# EAGLE design DRONE V3.0 (EAGLE 9.6.2)
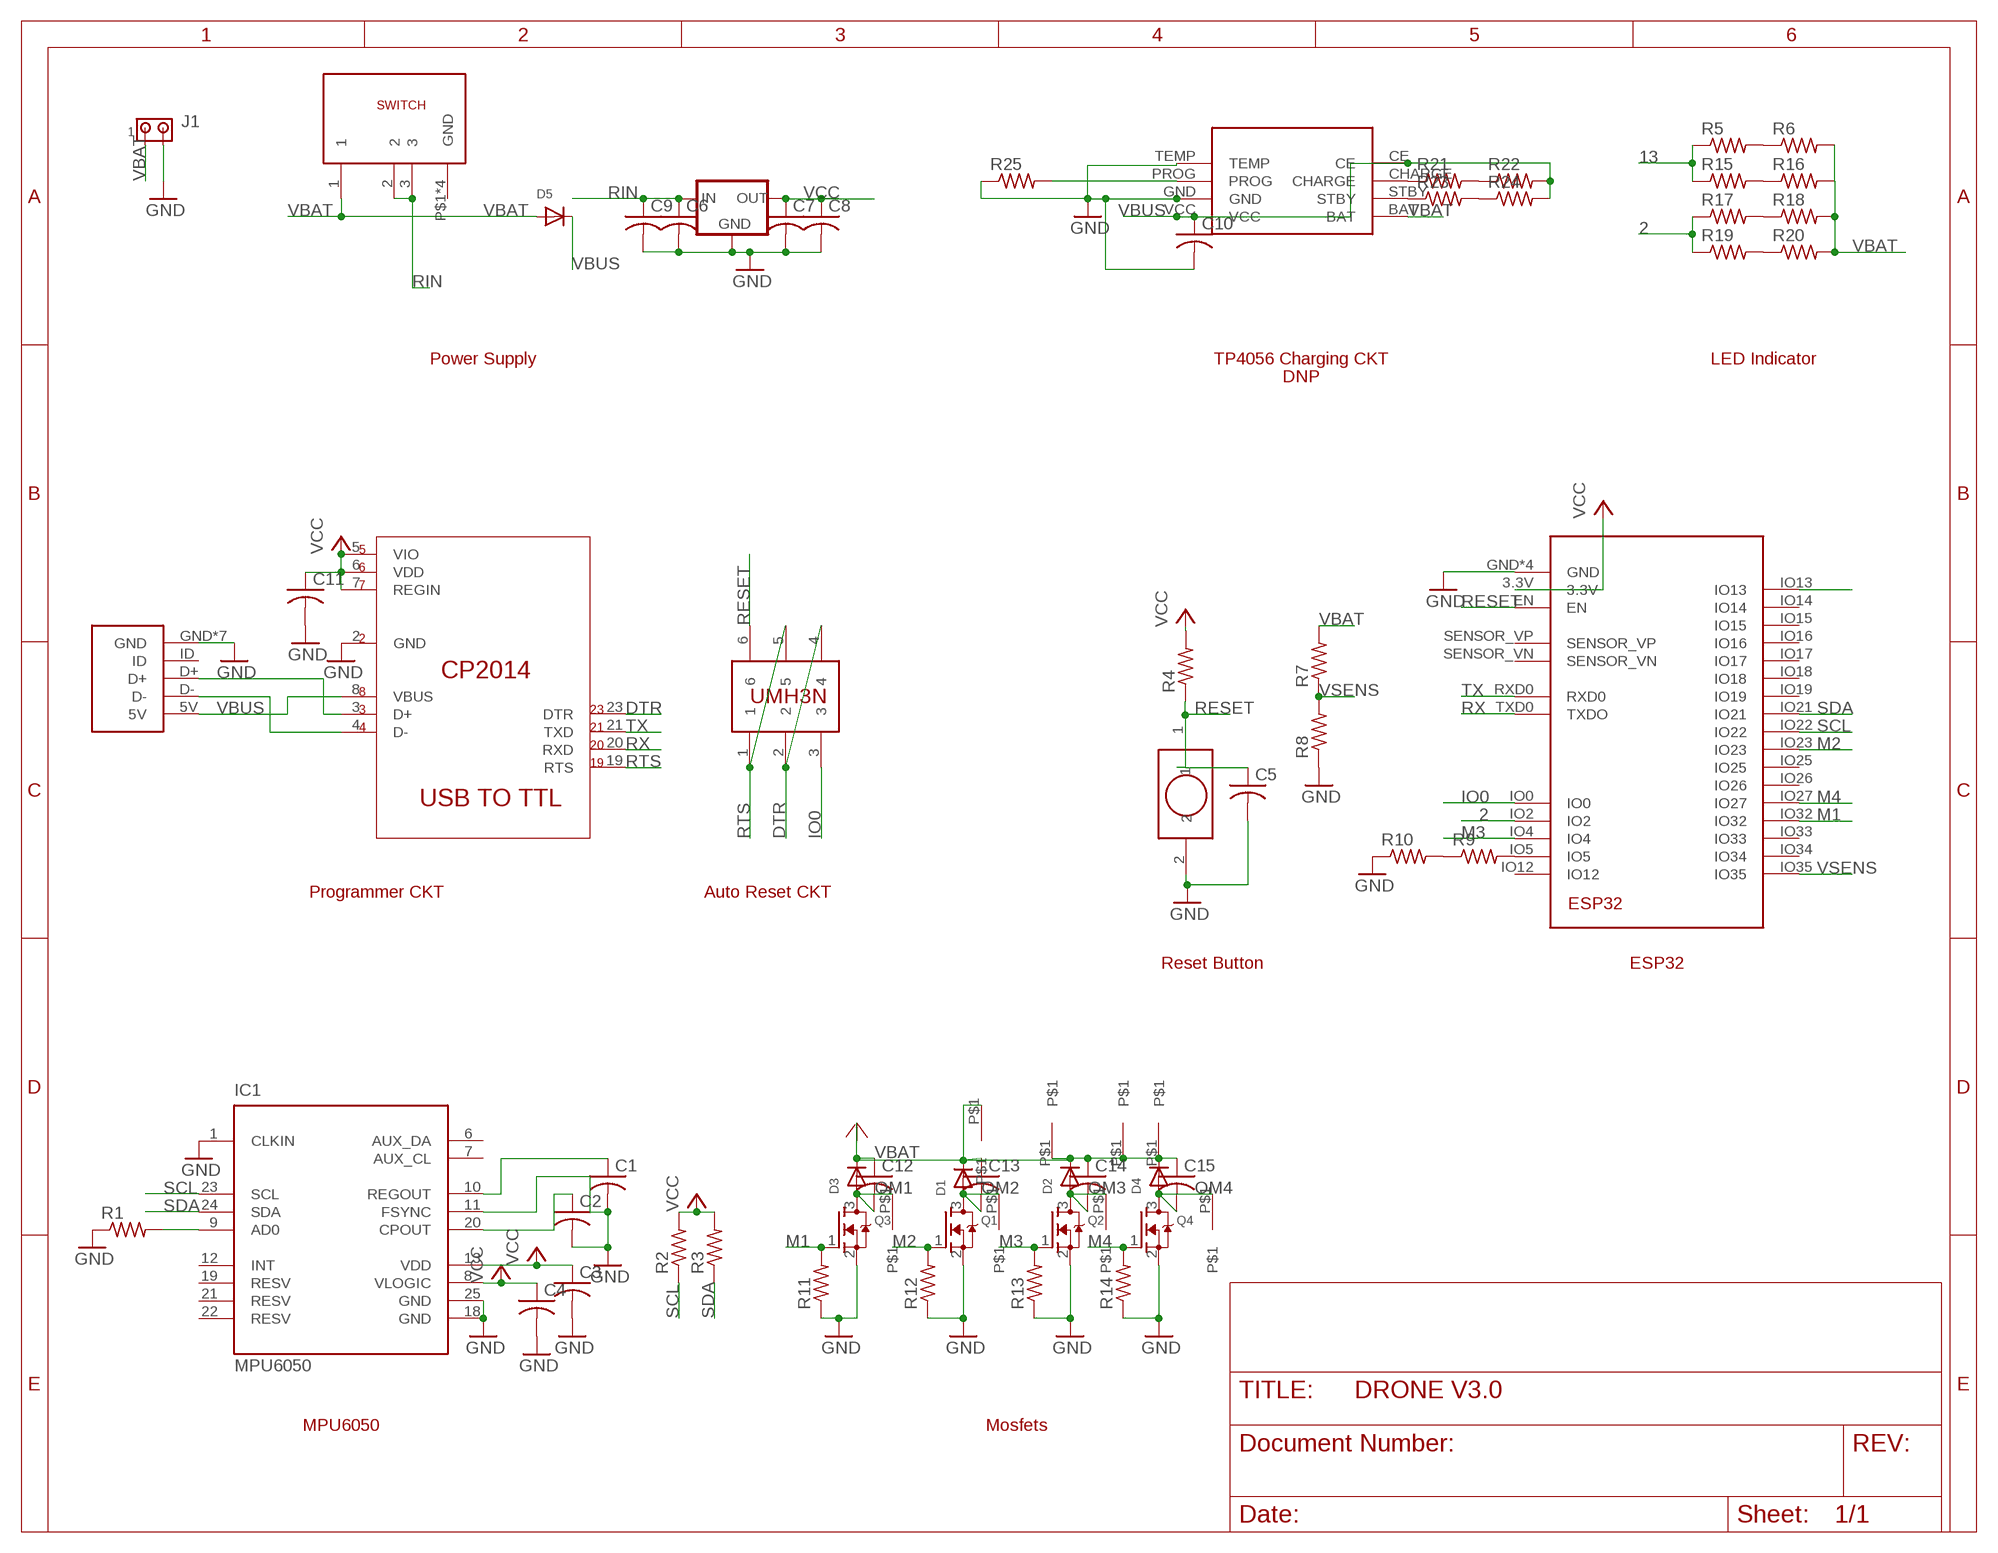
[diagram p0: schematic, sheet 1]

## Parts
C1  C-USC0603  [C0603]
C2  C-USC0603  [C0603]
C3  C-USC0603  [C0603]
C4  C-USC0603  [C0603]
C5  C-USC0603  [C0603]
C6  C-USC0603  [C0603]
C7  C-USC0603  [C0603]
C8  C-USC0603  [C0603]
C9  C-USC0603  [C0603]
C10  C-USC0603  [C0603]
C11  C-USC0603  [C0603]
C12  C-USC0603  [C0603]
C13  C-USC0603  [C0603]
C14  C-USC0603  [C0603]
C15  C-USC0603  [C0603]
D1  DIODESOD-323F  [SOD-323F]
D2  DIODESOD-323F  [SOD-323F]
D3  DIODESOD-323F  [SOD-323F]
D4  DIODESOD-323F  [SOD-323F]
D5  DIODESOD-323F  [SOD-323F]
IC1  MPU6050  [QFN50P400X400X95-25T265X275N]
IC2  V_REG1.8MP  [SOT223]
J1  MTA02-100  [10X02MTA]
Q1  MOSFET-NREFLOW  [SOT23]
Q2  MOSFET-NREFLOW  [SOT23]
Q3  MOSFET-NREFLOW  [SOT23]
Q4  MOSFET-NREFLOW  [SOT23]
R1  R-US_R0603  [R0603]
R2  R-US_R0603  [R0603]
R3  R-US_R0603  [R0603]
R4  R-US_R0603  [R0603]
R5  R-US_R0603  [R0603]
R6  R-US_R0603  [R0603]
R7  R-US_R0603  [R0603]
R8  R-US_R0603  [R0603]
R9  R-US_R0603  [R0603]
R10  R-US_R0603  [R0603]
R11  R-US_R0603  [R0603]
R12  R-US_R0603  [R0603]
R13  R-US_R0603  [R0603]
R14  R-US_R0603  [R0603]
R15  R-US_R0603  [R0603]
R16  R-US_R0603  [R0603]
R17  R-US_R0603  [R0603]
R18  R-US_R0603  [R0603]
R19  R-US_R0603  [R0603]
R20  R-US_R0603  [R0603]
R21  R-US_R0603  [R0603]
R22  R-US_R0603  [R0603]
R23  R-US_R0603  [R0603]
R24  R-US_R0603  [R0603]
R25  R-US_R0603  [R0603]
U1  ESP32  [MODULE_ESP-WROOM-32]
U2  CP2104-F03-GM  [QFN50P400X400X80-25N]
U$1  MICROUSB  [USB]
U$2  SELF_PUSHBUTTON  [SELF_PUSHBUTTON]
U$3  SWITCH  [SWITCH]
U$4  TP4056  [TP4056]
U$6  UMH3N  [UMH3N]
U$7  PINOUTS  [PINOUTS]
U$8  PINOUTS  [PINOUTS]
U$9  PINOUTS  [PINOUTS]
U$10  PINOUTS  [PINOUTS]
U$11  PINOUTS  [PINOUTS]
U$12  PINOUTS  [PINOUTS]
U$13  PINOUTS  [PINOUTS]
U$14  PINOUTS  [PINOUTS]

## Nets
2: R17.1 R19.1 U1.IO2
13: R5.1 R15.1 U1.IO13
DTR: U2.23(DTR) U$6.2 U$6.4
GND: C1.2 C2.2 C3.2 C4.2 C5.2 C6.2 C7.2 C8.2 C9.2 C10.2 C11.2 IC1.1(CLKIN) IC1.11(FSYNC) IC1.18(GND) IC1.25(GND) IC2.GND J1.2 Q1.2(S) Q2.2(S) Q3.2(S) Q4.2(S) R1.1 R8.1 R10.1 R11.1 R12.1 R13.1 R14.1 R25.1 U1.GND U1.GND1(GND) U1.GND2(GND) U1.GND3(GND) U2.2(GND) U$1.GND U$1.GND1(GND) U$1.GND2(GND) U$1.GND3(GND) U$1.GND4(GND) U$1.GND5(GND) U$1.GND6(GND) U$2.2 U$4.GND U$4.TEMP
IO0: U1.IO0 U$6.3
M1: Q3.1(G) R11.2 U1.IO32
M2: Q1.1(G) R12.2 U1.IO23
M3: Q2.1(G) R13.2 U1.IO4
M4: Q4.1(G) R14.2 U1.IO27
N$1: IC1.9(AD0) R1.2
N$2: R5.2 R6.1
N$3: R15.2 R16.1
N$4: C1.1 IC1.10(REGOUT)
N$5: C2.1 IC1.20(CPOUT)
N$6: U2.3(D+) U$1.D+
N$7: U2.4(D-) U$1.D-
N$8: R9.2 U1.IO5
N$9: R9.1 R10.2
N$10: R17.2 R18.1
N$11: R19.2 R20.1
N$12: R21.1 U$4.CHARGE
N$13: R21.2 R22.1
N$14: R23.1 U$4.STBY
N$15: R23.2 R24.1
N$16: R25.2 U$4.PROG
OM1: C12.2 D3.A Q3.3(D) U$12.P$1
OM2: C13.2 D1.A Q1.3(D) U$8.P$1
OM3: C14.2 D2.A Q2.3(D) U$10.P$1
OM4: C15.2 D4.A Q4.3(D) U$13.P$1
RESET: C5.1 R4.1 U1.EN U$2.1 U$6.6
RIN: C6.1 C9.1 IC2.VIN(IN) U$3.2 U$3.3
RTS: U2.19(RTS) U$6.1 U$6.5
RX: U1.TXD0(TXDO) U2.20(RXD)
SCL: IC1.23(SCL) R2.1 U1.IO22
SDA: IC1.24(SDA) R3.1 U1.IO21
TX: U1.RXD0 U2.21(TXD)
VBAT: C12.1 C13.1 C14.1 C15.1 D1.C D2.C D3.C D4.C D5.A J1.1 R6.2 R7.2 R16.2 R18.2 R20.2 U$3.1 U$4.BAT U$7.P$1 U$9.P$1 U$11.P$1 U$14.P$1
VBUS: C10.1 D5.C R22.2 R24.2 U2.8(VBUS) U$1.5V U$4.CE U$4.VCC
VCC: C3.1 C4.1 C7.1 C8.1 C11.1 IC1.8(VLOGIC) IC1.13(VDD) IC2.VOUT1(OUT) IC2.VOUT(OUT) R2.2 R3.2 R4.2 U1.3.3V U2.5(VIO) U2.6(VDD) U2.7(REGIN)
VSENS: R7.1 R8.2 U1.IO35
Unconnected: IC1.2(NC) IC1.3(NC) IC1.4(NC) IC1.5(NC) IC1.6(AUX_DA) IC1.7(AUX_CL) IC1.12(INT) IC1.14(NC) IC1.15(NC) IC1.16(NC) IC1.17(NC) IC1.19(RESV) IC1.21(RESV) IC1.22(RESV) U1.IO12 U1.IO14 U1.IO15 U1.IO16 U1.IO17 U1.IO18 U1.IO19 U1.IO25 U1.IO26 U1.IO33 U1.IO34 U1.SENSOR_VN U1.SENSOR_VP U$1.ID U$3.P$1(GND) U$3.P$2(GND) U$3.P$3(GND) U$3.P$4(GND)

## Notes on the sheet
- Power Supply | TP4056 Charging CKT | LED Indicator
- DNP
- Programmer CKT | Auto Reset CKT
- Reset Button | ESP32
- MPU6050 | Mosfets

## Library data of the parts
C1-C15 = rcl:C-US: CAPACITOR, American symbol; SPICEPREFIX: C
D1-D5 = adafruit:DIODE: Diode SMADIODE - SMA Surface Mount Package 20V 1A Schottky Diode Digikey: 641-1014-6-ND DO-1N4148 - Through Hole Small Current Diode SOD-123 20V 1 A (.5mV Vf) Schottky Diode - Digikey: MBRX120TPMSCT-ND SOD-323 10V 570mA (.38mV Vf, 3ns) Schottky Diode - Digikey: ZLLS410CT-ND SOD-523 30V 30mA Schottky Diode (RB751S-40TE61) - Digikey: RB751S-40TE61CT-ND SOT23-R/W - SOT23 Package (R = Solder Paste/Reflow Ovens, W = Hand-Soldering) BAT54Film 40V 300mA - Digikey: 497-7162-1-ND
IC1 = MPU6050,6000:MPU6050: The triple-axis MEMS gyroscope
IC2 = V_REG:V_REG: 800mA Low-Dropout Linear Regulator Source: http://www.ti.com/lit/ds/symlink/lm1117-n.pdf; MF: Texas Instruments; MPN: LM1117MP-1.8; OC_FARNELL: 1469053; OC_NEWARK: 41K3467
J1 = con-amp:MTA02-100: AMP connector
Q1-Q4 = adafruit:MOSFET-N: N-Channel Mosfet 2N7002E - 60V 260mA SOT23 [Digikey: 2N7002ET1GOSTR-ND] - REEL BSH103 - 30V 850mA SOT23 [Digikey: 568-5013-1-ND]
R1-R25 = rcl:R-US_: RESISTOR, American symbol; SPICEPREFIX: R
U1 = ESP-WROOM-32:ESP32: Module: combo; GPIO, I2C x2, I2S x2, SDIO, SPI x3, UART x3; 19.5dBm
U2 = CP2104:CP2104: Silabs CP2104 USB to UART Bridge; AVAILABILITY: Unavailable; DESCRIPTION: USB Bridge, USB to UART USB 2.0 UART Interface 24-QFN (4x4); MF: Silicon Labs; MP: CP2104; PACKAGE: QFN-24 Silicon Labs; PRICE: None
U$1 = micro usb:MICROUSB
U$2 = SELF-PUSHBUTTON:SELF_PUSHBUTTON
U$3 = SWITCH:SWITCH
U$4 = TP4056:TP4056
U$6 = UMH3N:UMH3N
U$7-U$14 = PIN:PINOUTS

## Board
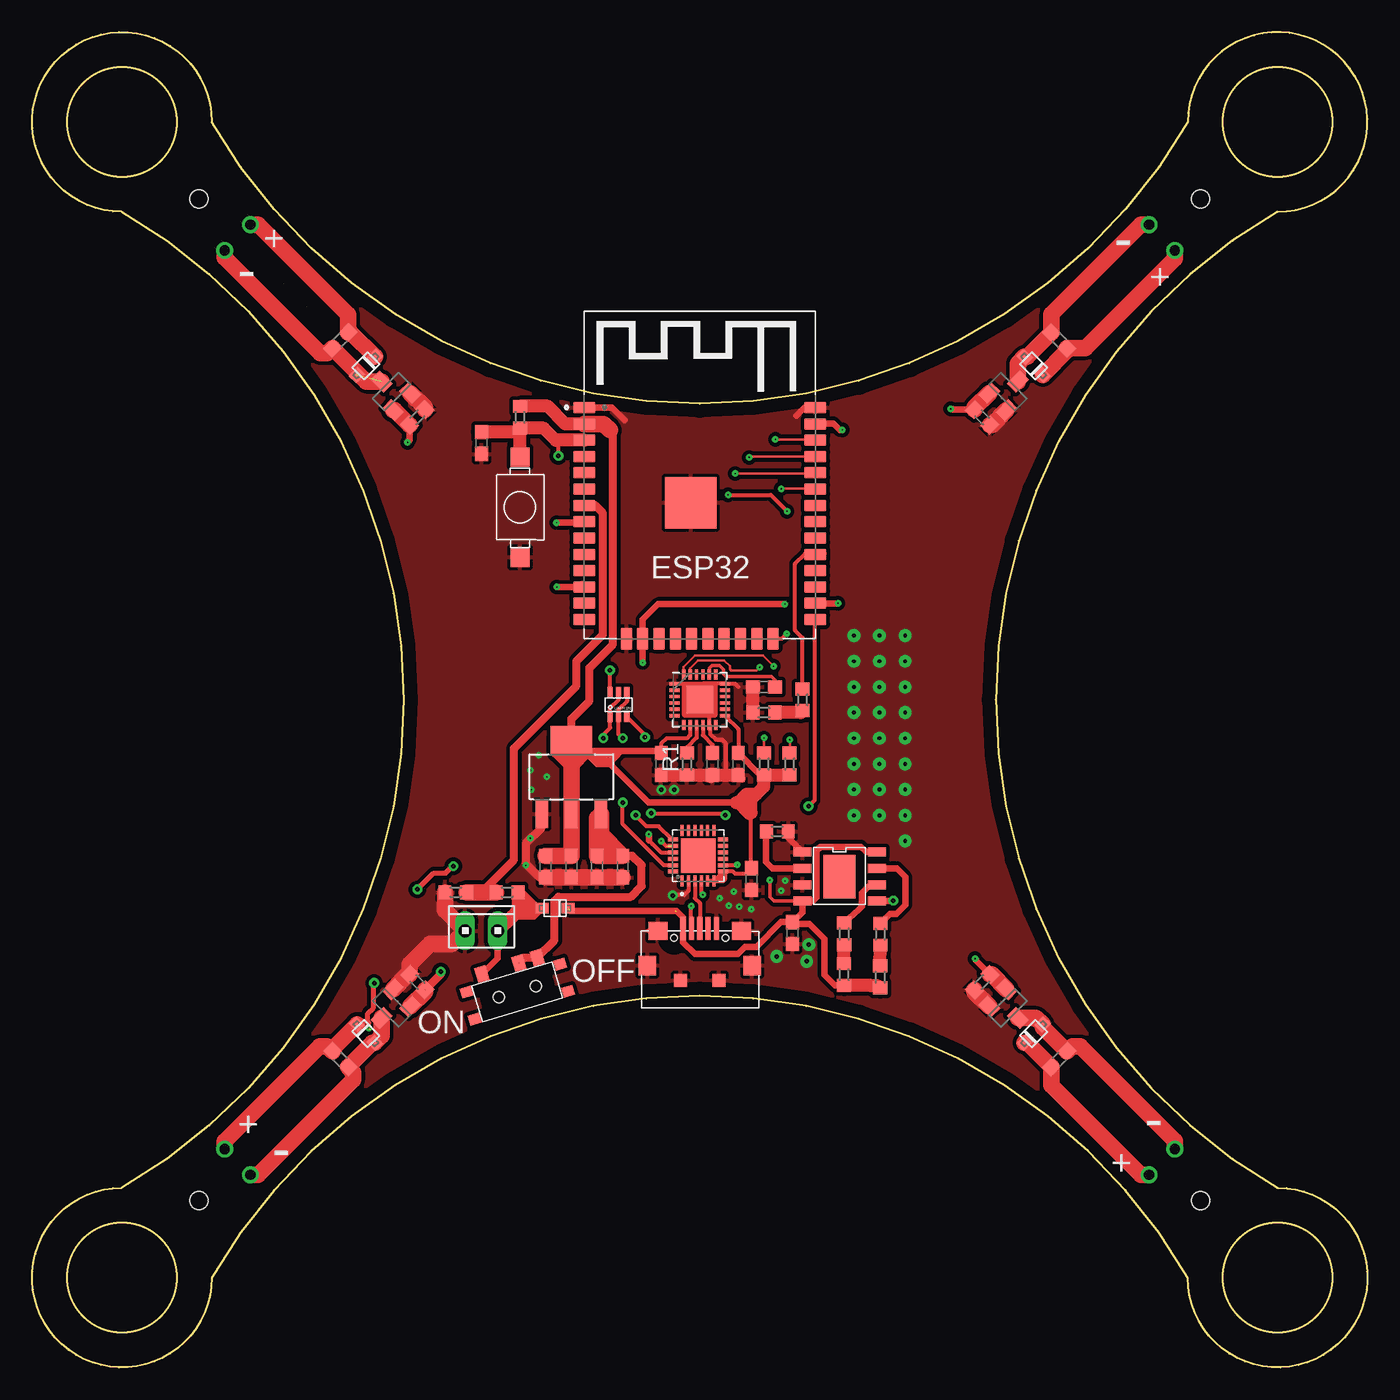
[diagram p1: board, top side]
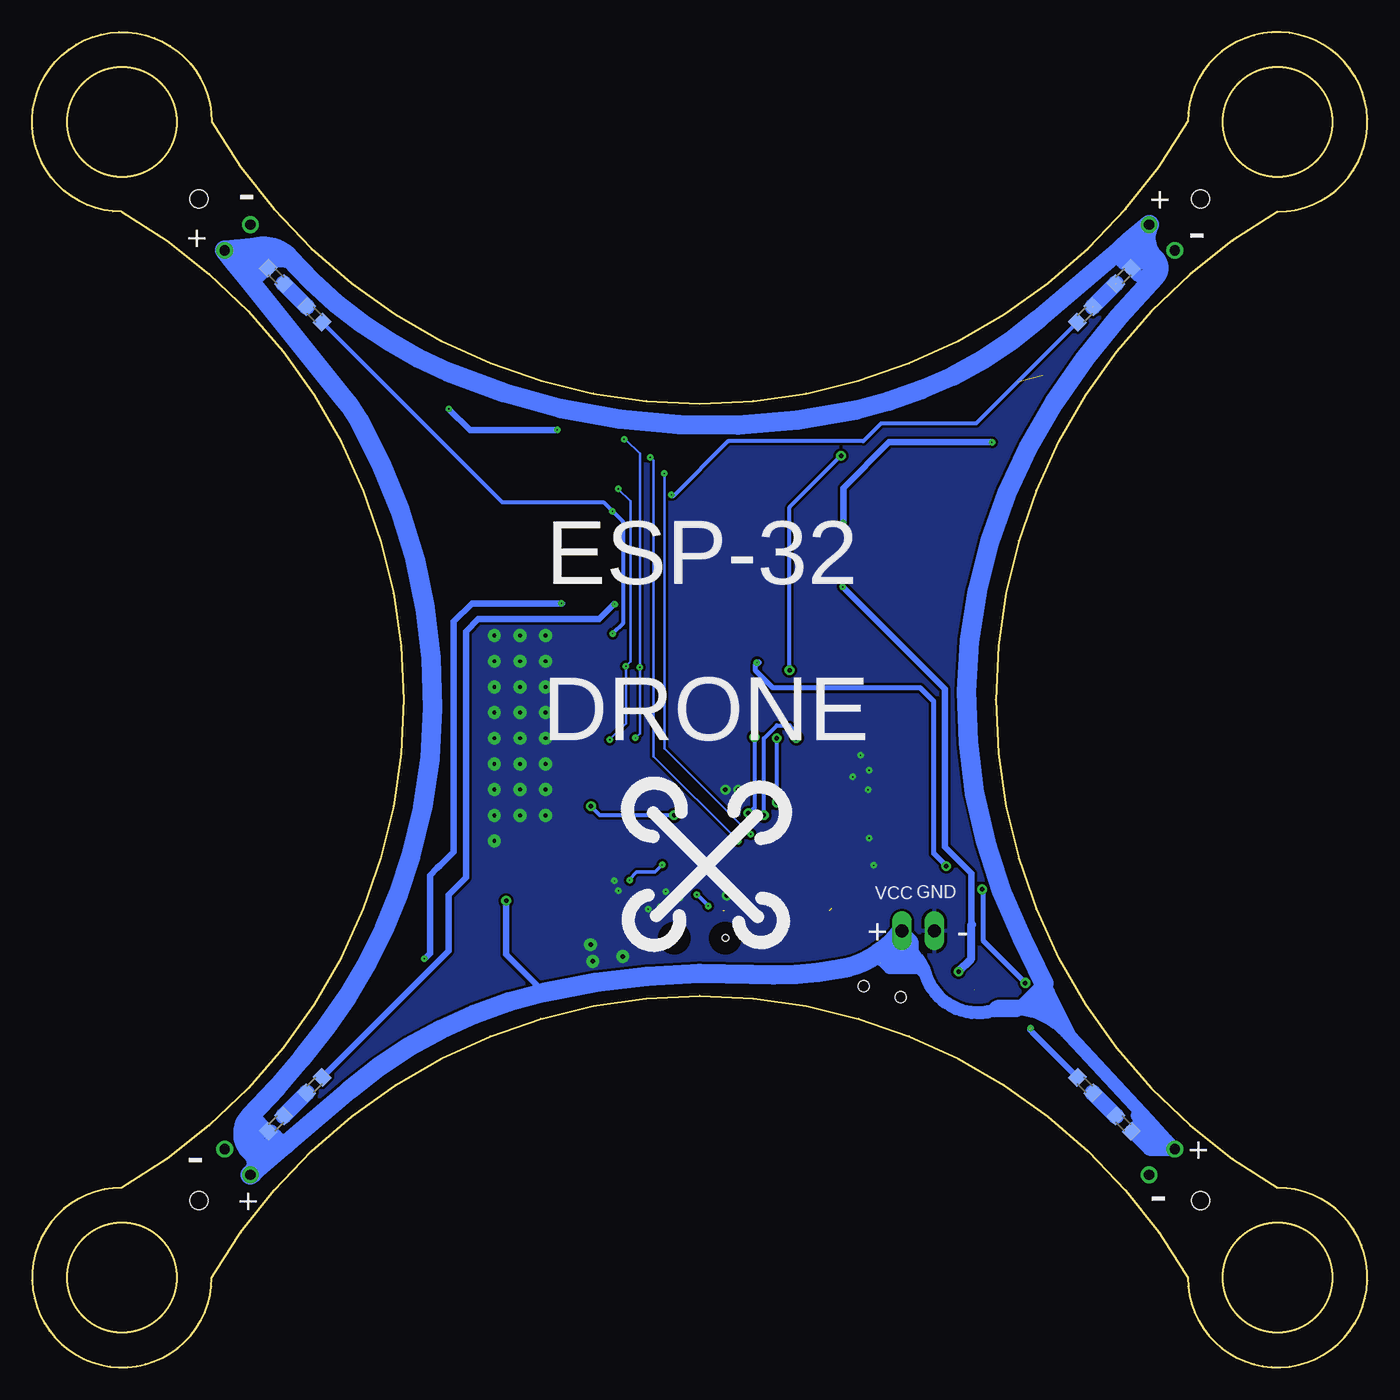
[diagram p2: board, bottom side, seen from below]

Size 103.99 x 103.99 mm. Coordinates in mm from the lower left corner, seen from the top.
Outline: 7,90 arc-120 7,14 arc270 14,7 arc-120 90,7 arc270 97,14 arc-120 97,90 arc270 90,97 arc-120 14,97 arc270 7,90
Outline: circle at 7,97 radius 4.25
Outline: circle at 97,97 radius 4.25
Outline: circle at 7,7 radius 4.25
Outline: circle at 97,7 radius 4.25
Copper layers (1*16): Top 0.035mm / dielectric 1.5mm / Bottom 0.035mm
Design rules "default *": minimum track width 6mil, minimum drill 0.35mm, track to track 6mil, track to pad 6mil, pad to pad 6mil, via to via 6mil, smd to smd 6mil, copper to edge 40mil, drill to drill 6mil, minimum pad ring 10mil, minimum via ring 8mil, stop-mask expansion 4mil, vias tented up to drill 100mil, thermal gap 10mil
Holes 1.4 mm at 13,91 91,91 91,13 13,13

### Footprints (pad centres in the part's own frame; a part is rotated, then mirrored left to right if it is on the bottom)
C0603 = smd 1.1 x 1: 1 -0.85,0; 2 0.85,0
SOD-323F = smd 1 x 0.8: A -1,0; C 1,0
QFN50P400X400X95-25T265X275N = smd 0.26 x 0.79: 1 -1.25,-1.97; 2 -0.75,-1.97; 3 -0.25,-1.97; 4 0.25,-1.97; 5 0.75,-1.97; 6 1.25,-1.97; 13 1.25,1.97; 14 0.75,1.97; 15 0.25,1.97; 16 -0.25,1.97; 17 -0.75,1.97; 18 -1.25,1.97 | smd 0.79 x 0.26: 7 1.97,-1.25; 8 1.97,-0.75; 9 1.97,-0.25; 10 1.97,0.25; 11 1.97,0.75; 12 1.97,1.25; 19 -1.97,1.25; 20 -1.97,0.75; 21 -1.97,0.25; 22 -1.97,-0.25; 23 -1.97,-0.75; 24 -1.97,-1.25 | smd 2.15 x 2.05: 25 0,0
SOT223 = smd 0.95 x 2.15: GND -2.3,-2.9; VIN 2.3,-2.9; VOUT 0,-2.9 | smd 3.25 x 2.15: VOUT1 0,2.9
10X02MTA = drill 1.016 long: 1 1.27,0; 2 -1.27,0
SOT23 = smd 1 x 1.4: 1 -0.95,-1.1; 2 0.95,-1.1; 3 0,1.1
R0603 = smd 1 x 1.1: 1 -0.85,0; 2 0.85,0
MODULE_ESP-WROOM-32 = smd 1.7 x 0.9: 3.3V -9,6.985; EN -9,5.715; GND -9,8.255; GND3 9,8.255; IO0 9,-8.255; IO4 9,-6.985; IO5 9,-3.175; IO12 -9,-8.255; IO14 -9,-6.985; IO16 9,-5.715; IO17 9,-4.445; IO18 9,-1.905; IO19 9,-0.635; IO21 9,1.905; IO22 9,5.715; IO23 9,6.985; IO25 -9,-3.175; IO26 -9,-4.445; IO27 -9,-5.715; IO32 -9,-0.635; IO33 -9,-1.905; IO34 -9,1.905; IO35 -9,0.635; NC 9,0.635; RXD0 9,3.175; SENSOR_VN -9,3.175; SENSOR_VP -9,4.445; TXD0 9,4.445 | smd 0.9 x 1.7: CLK 0.635,-9.755; CMD -0.635,-9.755; GND2 -5.715,-9.755; IO2 5.715,-9.755; IO13 -4.445,-9.755; IO15 4.445,-9.755; SD0 1.905,-9.755; SD1 3.175,-9.755; SD2 -3.175,-9.755; SD3 -1.905,-9.755 | smd 4 x 4: GND1 -0.7,0.845
QFN50P400X400X80-25N = smd 0.81 x 0.26: 1 -1.955,1.25; 2 -1.955,0.75; 3 -1.955,0.25; 4 -1.955,-0.25; 5 -1.955,-0.75; 6 -1.955,-1.25; 13 1.955,-1.25; 14 1.955,-0.75; 15 1.955,-0.25; 16 1.955,0.25; 17 1.955,0.75; 18 1.955,1.25 | smd 0.26 x 0.81: 7 -1.25,-1.955; 8 -0.75,-1.955; 9 -0.25,-1.955; 10 0.25,-1.955; 11 0.75,-1.955; 12 1.25,-1.955; 19 1.25,1.955; 20 0.75,1.955; 21 0.25,1.955; 22 -0.25,1.955; 23 -0.75,1.955; 24 -1.25,1.955 | smd 2.68 x 2.68: 25 0,0
USB = smd 0.4 x 1.8: 5V -1.298,0.204; D+ 0.002,0.204; D- -0.648,0.204; GND 1.302,0.204; ID 0.652,0.204 | smd 1.5 x 1.4: GND1 3.25,0; GND6 -3.25,0 | smd 1.35 x 1.5: GND2 4.075,-2.7; GND5 -4.075,-2.7 | smd 1 x 1: GND3 1.5,-3.85; GND4 -1.5,-3.85 | hole 0.5: -2,-0.55; 2,-0.55
SELF_PUSHBUTTON = smd 1.5 x 1.5: 1 0,3.9; 2 0,-3.9
SWITCH = smd 0.9 x 1.2: 1 2.25,-2.1; 2 -0.75,-2.1; 3 -2.25,-2.1 | smd 0.9 x 0.8: P$1 3.8,1.1; P$2 -3.8,1.1; P$3 3.8,-1.1; P$4 -3.8,-1.1 | hole 0.9: 1.5,0; -1.5,0
TP4056 = smd 1.4 x 0.7: BAT 2.9,-1.27; CE 2.9,2.54; CHARGE 2.9,1.27; GND -2.9,0; PROG -2.9,1.27; STBY 2.9,0; TEMP -2.9,2.54; VCC -2.9,-1.27 | smd 2.5 x 3.4: PAD 0,0.635
UMH3N = smd 0.4 x 0.8: 1 -0.65,-0.97; 2 0,-0.97; 3 0.65,-0.97; 4 0.65,0.97; 5 0,0.97; 6 -0.65,0.97
PINOUTS = drill 0.8 pad 1.3: P$1 0,0

### Placement (x,y rotation side)
C1  53,47 270 top
C2  57,53 180 top
C3  55,47 270 top
C4  49,47 270 top
C5  35,72 270 top
C6  44,39 270 top
C7  42,39 270 top
C8  40,39 270 top
C9  46,39 270 top
C10  59.22,33.83 270 top
C11  56.02,38.03 270 top
C12  24,80 225 top
C13  80,80 135 top
C14  80,24 45 top
C15  24,24 315 top
D1  78,78 315 top
D2  78,26 225 top
D3  26,78 45 top
D4  26,26 134 top
D5  40.73,35.76 0 top
IC1  52,52 270 top
IC2  42,46 0 top
J1  35,34 0 top
Q1  76,76 315 top
Q2  76,28 225 top
Q3  28,76 45 top
Q4  28,28 135 top
R1  51,47 90 top
R2  57,47 270 top
R3  59,47 270 top
R4  38,74 90 top
R5  22,22 315 bottom
R6  19,19 315 bottom
R7  37,37 0 top
R8  33,37 0 top
R9  60,52 90 top
R10  57,51 0 top
R11  30,74 225 top
R12  74,74 135 top
R13  74,30 45 top
R14  30,30 315 top
R15  82,22 225 bottom
R16  85,19 225 bottom
R17  22,82 45 bottom
R18  19,85 45 bottom
R19  82,82 135 bottom
R20  85,85 135 bottom
R21  66.06,33.73 270 top
R22  66.04,30.4 270 top
R23  63.24,33.76 270 top
R24  63.24,30.6 270 top
R25  58.04,41.75 180 top
U1  52,66.5 0 top
U2  51.87,39.86 90 top
U$1  52,34 0 top
U$2  38,67 0 top
U$3  37.79,29.26 196.6 top
U$4  62.88,37.59 0 top
U$6  45.67,51.62 0 top
U$7  89,87 0 top
U$8  87,89 0 top
U$9  87,15 0 top
U$10  89,17 0 top
U$11  17,89 0 top
U$12  15,87 0 top
U$13  17,15 0 top
U$14  15,17 0 top

### Tracks (layer width: path | path; a pad name or v marks a point on that pad's centre or on a via)
2  (via drill 0.1 pad 0.2)
  Top 0.3: v58.78,57.15 58.37,56.74 U1.IO2 | v54.2,67.95 57.52,67.95 v58.8,66.68 58.83,66.65
  Bottom 0.3: R19.1 67.39,67.39 59.51,67.39 v58.8,66.68 57.99,65.87 57.99,57.94 v58.78,57.15 | R17.1 30.49,73.5 37.88,73.5 39.26,72.13 49.79,72.13 54.08,67.84 v54.2,67.95
13  (via drill 0.1 pad 0.2, 0.35 pad 0.2)  (1 unrouted)
  Top 0.406: v26.23,26.4 26.23,26.86 26.14,26.95 26.14,27.56 26.59,28.01 26.59,29.94 v26.64,29.94 | v30,37.22 31.27,38.5 32.22,38.5 32.76,39.03 v32.8,39.03
  Top 0.508: v58.63,59.45 48.76,59.45 47.55,58.24 U1.IO13 v47.54,54.9
  Bottom 0.406: 26,26 26.31,26.31 | v26.64,29.94 29.9,33.2 29.9,37.24 v29.99,37.24 v30,37.22 | v32.8,39.03 33.77,40.01 33.77,51.87 34.83,52.93 46.3,52.93 47.66,54.29 47.66,54.67 47.43,54.9
  Bottom 0.508: R15.1 71.57,32.42 71.57,36.81 70.21,38.18 70.21,57.33 69.26,58.28 59.83,58.28 58.66,59.45 v58.63,59.45 | R5.1 26,26 | 47.43,54.9 v47.54,54.9
DTR  (via drill 0.35 pad 0.2)
  Top 0.305: U$6.4 46.32,51.87 45.67,51.22 U$6.2 45.67,49.33 v46,49 | U2.23 49.2,39.1 46,42.31 v46,44
  Bottom 0.305: v46,44 v46,49
GND  (via drill 0.1 pad 0.2, 0.3 pad 1, 0.35, 0.35 pad 1)
  Top 0.3: IC1.18 54.75,53.25 55,53 | U$1.GND6 48,34
  Top 0.305: C1.2 52.85,46 52.47,46 52.47,46.09 54,46.09 54,48.63 53.74,48.89 53.25,48.89 52.81,49.32 52.81,49.96 IC1.11 52.75,51.75 53,52 | IC1.18 52.25,53.25 52,53 51.75,53.25 IC1.1 | U2.2 51.12,37.12 50.79,36.79 49.93,36.79 v49.89,36.75
  Top 0.508: U$4.TEMP 58.89,41.22 R25.1 | U1.GND3 60.15,74.75 59.51,74.11 | U1.GND 45.17,74.75 46.15,73.77
  Top 0.61: C8.2 39.53,38.15 38.48,39.19 38.48,40.85 39.7,42.07 IC2.GND | C3.2 55.29,45.86
  Top 1: R10.1 C2.2
  Top 1.016: C4.2 R1.1 52.7,46.15 52.85,46 | C1.2 C3.2
  Top 1.27: C8.2 C7.2 C6.2 C9.2 | Q2.2 73.4,29.25 R13.1 | Q1.2 74.74,73.4 R12.1 | Q3.2 30.6,74.74 R11.1 | Q4.2 29.25,30.6 R14.1 29.4,31.4 31,33 32.73,33 J1.2 32.15,35.58 R8.1
  other vias: 58.63,37.89 58.32,37.14 53.54,36.53 54.65,37.06 54.25,35.94 55.07,35.88 56.02,35.69 39.48,47.68 38.79,46.52 40.08,45.99 38.9,44.98 38.46,39.1 38.79,41.22 64,57 66,57 68,57 68,55 68,53 68,51 68,49 68,47 68,45 68,43 68,41 66,43 64,43 66,45 66,47 66,49 66,51 66,53 66,55 64,55 64,53 64,51 64,49 64,47 64,45 58,32 60.32,31.62 60.49,32.92 49,45 50,45
  pour Bottom (isolate 0.2): -23,-5 -22,-4 -22,110 125,110 125,-7 124,-8 -20,-8
  pour Top (isolate 0.3): 0,3 0,105 102,105 106,101 106,4 101,-1 4,-1
IO0  (via drill 0.35, 0.35 pad 0.2)  (1 unrouted)
  Top 0.3: v60.47,43.7 60.93,44.16 60.93,58.18 U1.IO0
  Top 0.305: U$6.3 47.72,49.24 47.72,49.06 | v48.2,43.15 53.84,43.15 v54,43
  Bottom 0.305: v47.73,49.09 47.73,43.6 48.19,43.14 v48.2,43.15 | v54,43 59.76,43 v60.47,43.7
M1  (via drill 0.1 pad 0.2)
  Top 0.508: R11.2 29.4,72.23 29.22,72.06 v29.24,72.04 | v40.84,65.79 42.93,65.79 U1.IO32
  Top 0.61: U1.IO32 42.86,66
  Top 1.27: R11.2 28.24,74.55 Q3.1
  Bottom 0.508: v29.24,72.04 37.27,72.04 40.81,68.5 40.81,65.82 v40.84,65.79
M2  (via drill 0.1 pad 0.2)
  Top 0.508: R12.2 71.71,74.6 71.66,74.65 v71.55,74.65 | v63.11,73.01 62.9,73.01 62.39,73.52 61.03,73.52 U1.IO23
  Top 1.27: Q1.1 73.4,74.74 R12.2
  Bottom 0.508: v71.55,74.65 69.89,72.99 63.13,72.99 v63.11,73.01
M3  (via drill 0.1 pad 0.2)
  Top 0.508: R13.2 73.49,31.7 73.49,31.77 v73.43,31.82 | v62.77,59.51 U1.IO4
  Top 1.27: Q2.1 74.74,30.6 R13.2
  Bottom 0.508: v73.43,31.82 73,32.26 73,38.32 72.44,38.88 72.23,39.1 71.17,40.16 71.17,58.07 69.73,59.51 v62.77,59.51 62.75,59.51 62.73,59.49
M4  (via drill 0.1 pad 0.2, 0.35)  (1 unrouted)
  Top 0.508: v40.86,60.78 U1.IO27 | U1.IO27
  Top 0.61: R14.2 31.84,30.64 v31.84,30.83 | 42.83,60.95 U1.IO27
  Top 1.27: Q4.1 30.6,29.25 R14.2
  Bottom 0.508: 30.84,34 30.84,35.3 30.84,38.48 32.91,40.55 32.91,52.83 v40.86,60.78 37.65,57.57
  Bottom 0.61: v31.84,30.83 30.84,31.83 30.84,34 30.84,34.44 30.79,34.49
N$1
  Top 0.305: IC1.9 51.75,49.05 51,48.3 R1.2
N$2
  Bottom 1.27: R5.2 R6.1
N$3
  Bottom 1.27: R15.2 R16.1
N$4
  Top 0.305: IC1.10 52.25,49.24 53,48.49 C1.1
N$5
  Top 0.254: IC1.20 52.75,54.46 52.94,54.65 53.54,54.65 53.84,54.35 53.84,54 54.04,53.79 57.6,53.79 57.85,53.55 C2.1
N$6
  Top 0.305: U2.3 51.62,36.54 52,36.16 U$1.D+
N$7  (via drill 0.1 pad 0.2)
  Top 0.305: U$1.D- 51.33,34.22 v51.33,35.93 | v52.22,36.82 52.12,36.93 U2.4
  Bottom 0.305: v51.33,35.93 v52.22,36.82
N$8
  Top 0.3: R9.2 60,56.82 59.42,57.4 59.42,62.59 60.22,63.39 60.93,63.39 U1.IO5
  Top 0.508: 61.62,63.39 61.56,63.32 U1.IO5
N$9
  Top 1.016: R9.1 59.85,51 R10.2
N$10  (2 unrouted)
  Bottom 1.27: R17.2 R18.1
N$11
  Bottom 1.27: R19.2 R20.1
N$12
  Top 0.508: R21.1 66.8,35.32 67.3,35.32 68.01,36.02 68.01,38.2 67.34,38.86 U$4.CHARGE
N$13
  Top 1.016: R22.1 R21.2
N$14
  Top 0.508: R23.1 64.4,35.67 64.62,35.88 64.62,36.96 65.25,37.59 U$4.STBY
N$15
  Top 1.016: R24.1 R23.2
N$16
  Top 0.508: U$4.PROG 57.66,38.86 57.16,39.36 57.16,41.72 R25.2
OM1  (1 unrouted)
  Top 1.27: U$12.P$1 15,86.43 22.43,79 23,79 C12.2 26.02,76.77 Q3.3
OM2
  Top 1.27: Q1.3 76.77,78.19 D1.A 77.5,78.7 C13.2 79.4,82.02 86.37,89 U$8.P$1
OM3
  Top 1.27: Q2.3 78.19,27.22 D2.A 78.7,26.49 C14.2 81,25 81.65,25 89,17.65 U$10.P$1
OM4
  Top 1.27: Q4.3 27.22,25.8 D4.A 26.48,25.28 C15.2 25,23 25,22.39 17.6,15 U$13.P$1
RESET  (via drill 0.35 pad 0.2)
  Top 0.305: U$6.6 45,52.6 v45,54.29 | v41,71 41,72 40.78,72.21
  Top 1.016: U$2.1 R4.1 | R4.1 37.7,72.85 C5.1 | U1.EN 40.78,72.21 39.85,73.15 R4.1
  Bottom 0.305: v45,54.29 45,66.99 v41,71
RIN  (1 unrouted)
  Top 0.61: U$3.2 38.33,31.92 U$3.3 40.69,33.26 40.69,36.34 40.99,36.64 46.63,36.64 47.47,37.48 47.47,39.11 46.73,39.85 C9.1
  Top 1.27: C6.1 C9.1 44.3,41.55 IC2.VIN 44,42.8 C6.1
RTS  (via drill 0.35 pad 0.2)
  Top 0.305: U$6.5 45.67,51.99 44.98,51.3 44.98,50.68 U$6.1 45.02,49.81 44.47,49.27 v44.47,49.01 | v47,43 47.85,42.14 48.8,42.14 49.83,41.11 U2.19
  Bottom 0.305: v47,43 47,49 46,50 45,50 44.47,49.47 v44.47,49.01
RX  (via drill 0.1 pad 0.2)  (1 unrouted)
  Top 0.2: v55.85,70.87 55.92,70.94 U1.TXD0
  Top 0.305: 49.39,40.61 v49,41
  Bottom 0.2: v49,41 55.58,47.58 55.58,70.63 55.84,70.88 | 55.84,70.88 | 55.84,70.88 v55.85,70.87
SCL  (via drill 0.1 pad 0.2)
  Top 0.2: IC1.23 51.25,54.43 51.87,55.05 53.89,55.05 54.34,54.61 54.34,54.38 54.44,54.28 56.42,54.28 v56.66,54.53 | v56.66,54.53 | v57.01,49.02 R2.1 | v57.89,72.28 60.93,72.28 U1.IO22
  Top 0.305: 60.98,72.23 U1.IO22
  Bottom 0.2: v57.01,49.02 56.66,49.37 v56.66,54.53 56.66,71.15 57.79,72.28 v57.89,72.28
SDA  (via drill 0.1 pad 0.2)
  Top 0.2: IC1.24 50.75,54.56 51.63,55.45 56.92,55.45 v57.75,54.62 v57.75,54.61 | v59.01,48.88 59.01,47.86 R3.1 | v58.34,68.43 60.96,68.43 U1.IO21
  Top 0.305: 60.94,68.46 U1.IO21
  Bottom 0.2: v59.01,48.88 57.75,50.15 v57.75,54.61 57.4,54.96 57.4,67.48 58.34,68.42 v58.34,68.43
TX  (via drill 0.1 pad 0.2)
  Top 0.2: v54.77,69.62 60.94,69.62 U1.RXD0
  Top 0.305: U2.21 48.97,40.11 48.31,40.77 48.03,41.05
  Top 0.508: 48.03,41.05 v48.03,41.52
  Bottom 0.2: v48.03,41.52 54.72,48.21 54.72,69.62 54.74,69.64 | 54.74,69.64 | 54.74,69.64 v54.77,69.62
VBAT  (via drill 0.35)
  Top 0.508: U$4.BAT 67.05,36.32 v67.07,36.34 | D5.A 39.11,35.13 38,35.13 | 38,35.13 37.4,35.13 | 38,35.13 37.85,35.28 37.85,35.58 38.9,35.58 39.08,35.76 | J1.1 36.27,31.87 U$3.1
  Top 1: 39.08,35.76 R7.2 37.85,35.58 37.4,35.13 J1.1
  Top 1.27: D2.C 77.5,25.29 C14.1 79.4,21.96 86.36,15 U$9.P$1 | D1.C 80.6,79.18 C13.1 82.03,79.4 89,86.36 U$7.P$1 | U$11.P$1 17.59,89 24.6,81.99 C12.1 24.81,80.6 D3.C | D4.C 23.4,24.81 C15.1 23,25 22.39,25 15,17.6 U$14.P$1
  Bottom 0.508: v67.07,36.34 67.07,32.18 64.11,29.22
  Bottom 1: 16.56,86.37 17.63,86.37 18,86 17,86 17,85 17.79,85 R18.2 18.79,86 | 18.79,86 19,86 19.14,86.14 19.14,87.17 | 18.79,86 18.79,86.2 18,87 18.56,87.56 18.56,87.66 | 83.98,86.43 84.27,86.14 85.17,86.14 85.6,85.7 R20.2 | R20.2 85.64,85.6 86.69,84.54 87.02,84.54 | R20.2 85.88,85.88 85.88,86.82 86.34,87.29 | R20.2 86.49,86.49 86.88,86.49 | 88.09,85.87 88.09,85.95 87.55,86.49 86.88,86.49 | 87.72,85.41 87,85.41 | 87,85.41 85.78,85.41 R20.2 | 87,85.41 87,86.38 86.88,86.49 | 84.28,17.32 84.99,18.04 | 84.99,18.04 85.35,18.4 R16.2 | R16.2 86.79,19.59 87.01,19.59 87.01,18.62 86.42,18.03 | R16.2 86.05,18.4 86.42,18.03 | 86.42,18.03 86.62,17.82 | 86.62,17.82 | 86.62,17.82 86.66,17.85 86.89,17.62 86.89,16.73 | 86.62,17.82 85.86,17.05 85.86,17.01 85.87,17.01 85.87,17.15 84.99,18.04 | R6.2 17,17 U$14.P$1 | R6.2 17.08,18.4 16.39,17.7 15.65,17.7 | R6.2 17.43,19.36 17.43,19.62 17.93,19.62 17.53,19.22 17.06,19.22 | 34.42,30.64 34.9,31.12 37.2,31.12 37.85,31.77 37.84,31.78 | 37.84,31.78 | J1.1 36.27,32.51 36.96,31.82 36.96,31.8 | J1.1 36.27,31.93 35.97,31.63 | J1.1 35.48,33.21 35.48,32.3
  Bottom 1.016: 23.19,25.82 22.63,25.22 17.06,19.22 15.65,17.7 U$14.P$1 | 23.19,25.82 23.49,26.16 | 29.18,27.77 arc63 23.49,26.16 | 29.18,27.77 arc88 34.42,30.64 arc-31 35.48,32.3 | 23.19,25.82 24.84,29.21 | 24.84,29.21 25.18,29.91 27.32,27.77 29.18,27.77 | 23.49,26.16 25.44,28.1 | 24.84,29.21 25.44,28.61 25.44,28.1 | 25.44,28.1 28.85,28.1 29.18,27.77
  Bottom 1.5: 25.18,29.91 26.92,33.46 arc59 24.4,75.09 arc11 16.53,84.96 arc-91 16.56,86.37 arc75 U$11.P$1 18.56,87.66 19.14,87.17 25.64,81.62 arc28 39.82,74.57 arc35 71.6,77.53 arc25 83.98,86.43 arc-57 86.34,87.29 arc5 U$7.P$1 88.09,85.87 87.72,85.41 87.02,84.54 79.67,75.42 arc9 78.58,73.82 arc46 74.5,39.76 arc21 81.12,26.45 arc8 87.01,19.59 arc-94 86.89,16.73 arc106 U$9.P$1 84.28,17.32 79.28,21.6 arc28 64.11,29.22 arc16 47.97,30.61 arc-13 41.09,31.03 arc-43 J1.1
VBUS  (via drill 0.1 pad 0.2)  (2 unrouted)
  Top 0.254: v57.46,37.94 57.46,36.66 57.8,36.32 U$4.VCC
  Top 0.305: v54.93,39.13 54.9,39.11 U2.8
  Top 0.508: 50.19,35.55 50.7,35.04 U$1.5V 50.7,33.11 51.62,32.19 54.96,32.19 55.5,32.74 56.4,32.74 58.34,34.68 C10.1 | U$4.CE 64.96,40.13 64.55,40.55 61.38,40.55 61.09,40.25 61.09,36.59 60.82,36.32 U$4.VCC 59.98,35.43 C10.1 | R24.2 62.54,29.75 61.71,30.58 61.71,33.38 60.54,34.55 59.35,34.55 C10.1 | 50.06,35.55 41.94,35.55
  Top 1.016: R24.2 65.33,29.75 65.89,29.71 R22.2
  Bottom 0.254: v54.93,39.13 55.49,38.57 56.92,38.57 57.48,38.01 57.48,37.96 v57.46,37.94
VCC
  Top 0.305: IC1.8 51.25,49.25 51,49 49.41,49 49,48.58 C4.1 | IC1.13 55,49.72 C3.1 | 54,38.61 54.6,38.61 54.77,38.44 55.58,38.44 C11.1 56,38.9 56,42.79 | 56,42.79 56,43.3 | 56,43.3 56,43.9 | 56,44.19 56,44.23 56,44.41 55.78,44.19 | 56,44.19 56,43.93 | 55.65,44 55.58,44 | 55.71,43.93 55.65,44 | 55.48,44.48 55.78,44.19 | 55.78,44.19 56,44.19 | 55.01,44 55,44 55.52,43.47 | 55.3,44 55.58,44 | 55.58,44 55.78,44.19 | 55.65,44 55.93,44 56,43.93 | 55.71,43.93 55.08,43.93 55.01,44 | 55.71,43.93 56,43.93 | 55.01,44 55.3,44 | 55.3,44 55.7,43.6 | 55.7,43.6 55.82,43.47 | 56,43.93 56,43.9 | 56,43.9 55.7,43.6 | 55.82,43.47 55.52,43.47 | 55.82,43.47 56,43.3 | 55.52,43.47 55.52,43.27 55.89,42.9 | 55.89,42.9 56,42.79 | 55.52,43.47 55.89,43.11 55.89,42.9 | 45.43,47.43 46,48 45.61,48 45.31,47.69 | 45.19,47.19 45,47 45,48 45.31,47.69 | 45.43,47.43 45.43,47.57 45.31,47.69 | 45.31,47.69 44.81,47.19 | 45.43,47.43 45.19,47.19 | 45.19,47.19 45.19,46.81 | U2.6 53.46,38.25 | 53.46,38.25 53.56,38.35 | 53.56,38.35 U2.7 54,38.61 | U2.6 53.84,37.9 | 54,38.06 54,38.61 | 53.84,37.9 54,38.06 | 54,38.06 53.71,38.35 53.56,38.35 | 53.84,37.9 53.84,38.07 53.56,38.35 | 53.84,37.9 53.49,38.25 53.46,38.25 | U2.6 U2.5
  Top 0.508: C4.1 48.85,48 46,48 45,48 | 42.1,49 43.1,48 44,48 | 44,48 45,48 | 55.48,44.48 55,44 | 54.83,44 48,44 45.19,46.81 45,47 | 44,47 43.5,47.5 | 43.5,47.5 43,48 42.1,48.9 IC2.VOUT1 | 44,48 44.5,47.5 | 44.5,47.5 44.81,47.19 45,47 | 44,48 44,47 | 45,47 44,47 | 44.5,47.5 44,47 | 44,48 43.5,47.5 | 45,48 44.5,47.5 | R2.2 56.7,46.15 C3.1
  Top 0.61: IC2.VOUT1 42,50.51 43.4,51.92 43.4,54.47 45.23,56.3 45.23,72.77 45,73
  Top 1: R3.2 R2.2 57,45.23 56.41,44.64 | 55,44 55.77,44 56,44.23 | 56,44.23 56.41,44.64 | 55,44 55.89,43.11 56,43.22 56,44.23 | 55,44 54.83,44 | 55,44 55.64,44.64 56.41,44.64
  Top 1.016: U1.3.3V 41.51,73.48 40.15,74.85 R4.2
  Top 1.27: 42,47 IC2.VOUT C7.1 C8.1 | 42,47 41,48 41,49 42.1,49 | 42,47 43,48 43,49 42.1,49 | 42.1,49 IC2.VOUT1 | U1.3.3V 44.51,73.48 45,73
VSENS
  Top 0.61: 35,37 37.53,39.53 37.53,48.21 42.4,53.08 42.4,55 44.46,57.06 44.46,66.53 43.86,67.13 U1.IO35
  Top 1.27: R7.1 35,37 R8.2

### Text on the board
tPlace: + | - | - | + | OFF | ON | + | - | - | +
bPlace: + | - | - | + | ESP-32 | DRONE | GND | VCC | - | + | + | - | - | +